# Altium schematic sheet Main Display Module ESP32.SchDoc
size 381 x 241 mm; SheetNumber: 1; SheetTotal: 1
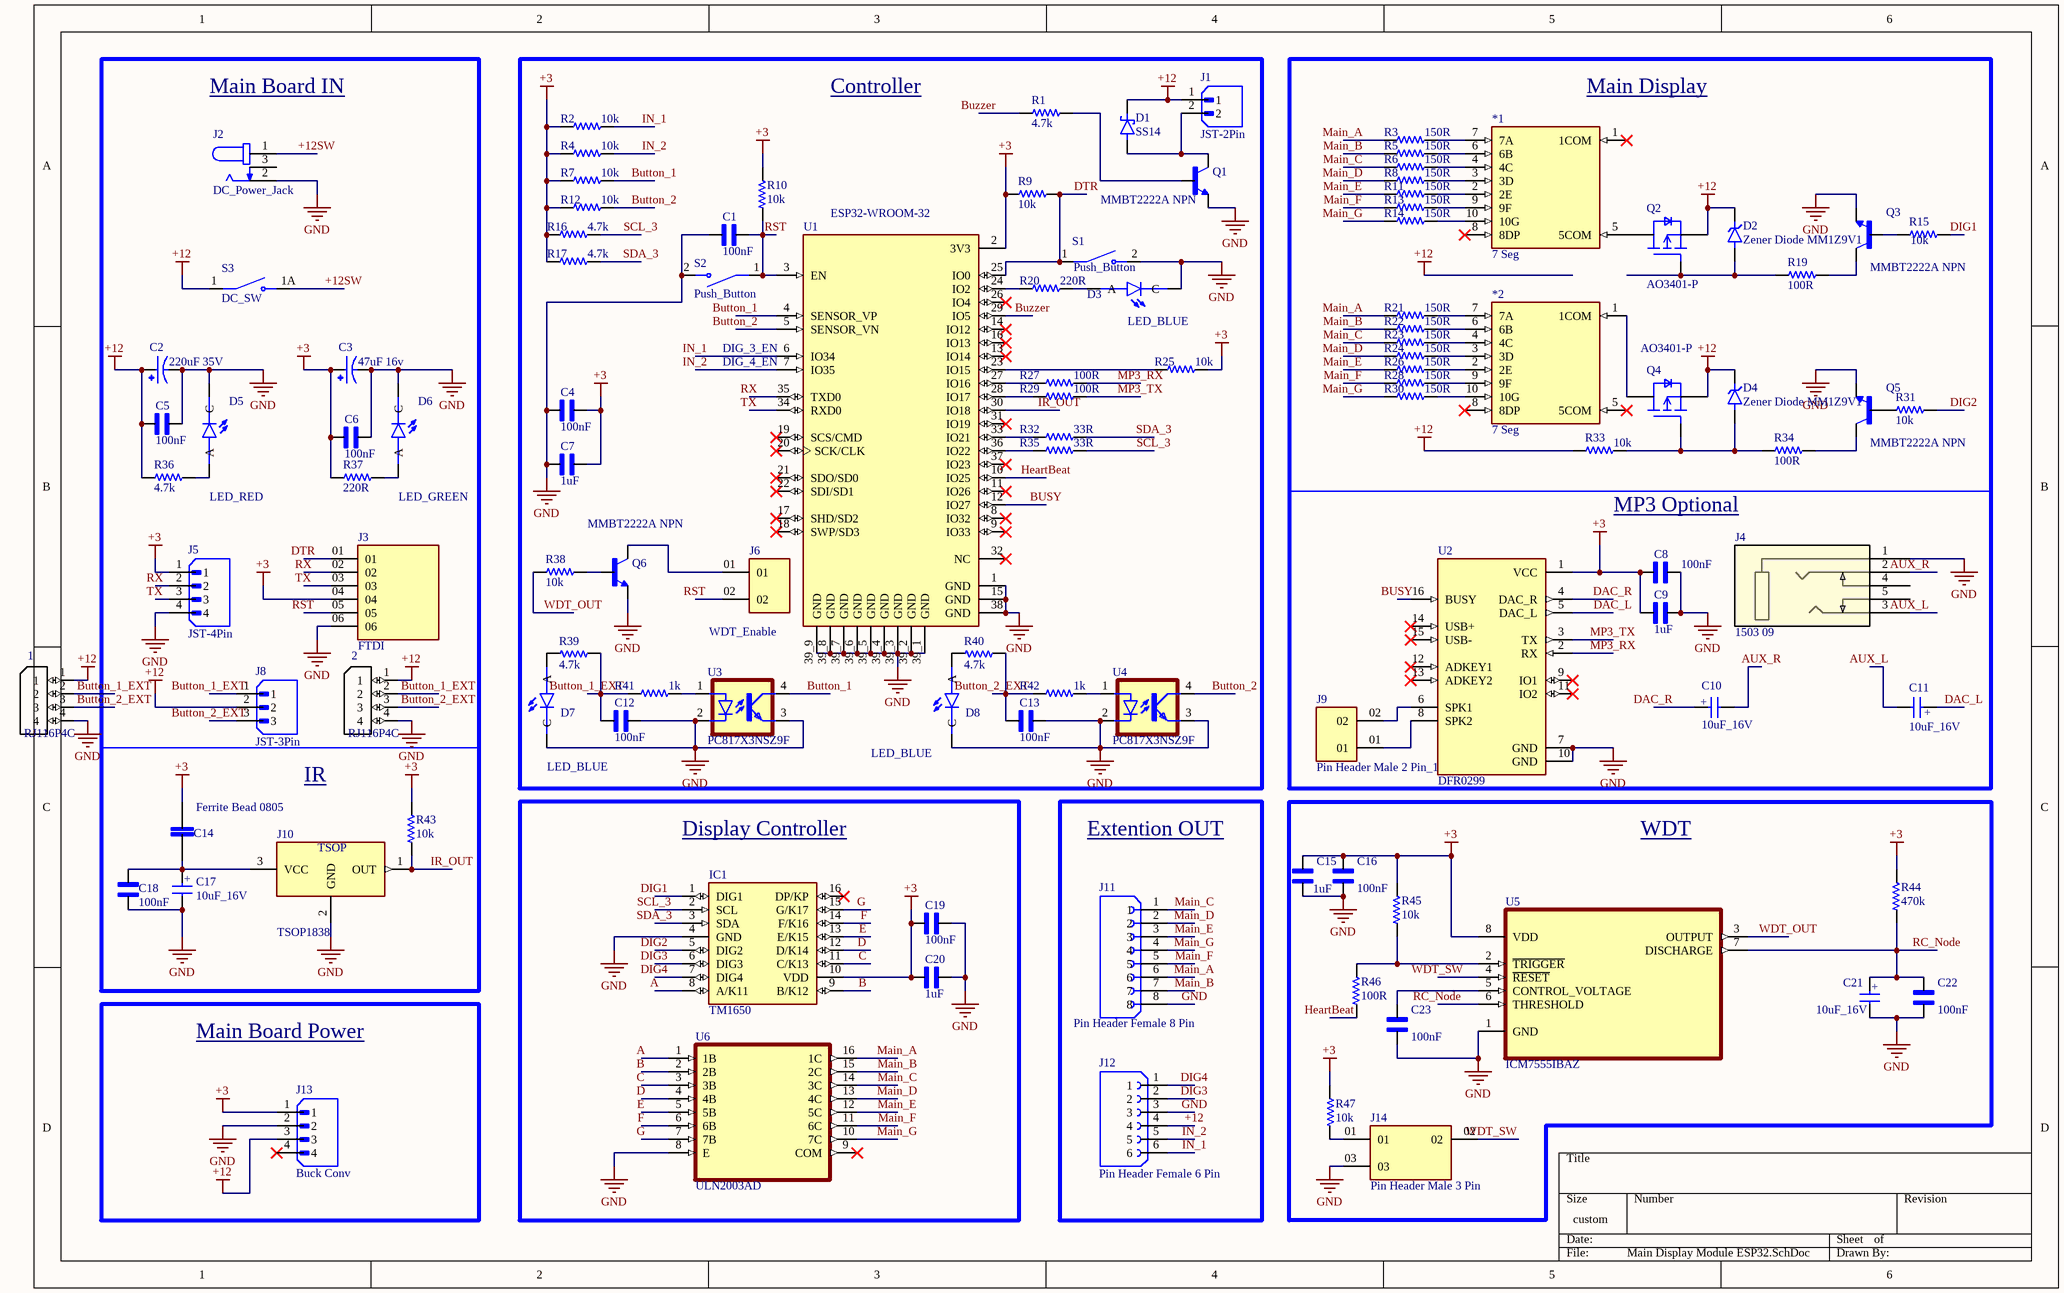
[diagram p0: Main Display Module ESP32.SchDoc]

## Parts
1  RJ116P4C  [*RJ6P4C]
2  RJ116P4C  [*RJ6P4C]
*1  7 Seg  [2.3_7-SEG_DIS]
*2  7 Seg  [2.3_7-SEG_DIS]
C1  100nF  [Capacitor 0805]
C2  220uF 35V  [220uF 35V]
C3  47uF 16v  [47uf 16v]
C4  100nF  [Capacitor 0805]
C5  100nF  [Capacitor 0805]
C6  100nF  [Capacitor 0805]
C7  1uF  [Capacitor 0805]
C8  100nF  [Capacitor 0805]
C9  1uF  [Capacitor 0805]
C10  10uF_16V  [10uF_16V]
C11  10uF_16V  [10uF_16V]
C12  100nF  [Capacitor 0805]
C13  100nF  [Capacitor 0805]
C14  Ferrite Bead 0805  [Ferrite Bead 0805]
C15  1uF  [Capacitor 0805]
C16  100nF  [Capacitor 0805]
C17  10uF_16V  [10uF_16V]
C18  100nF  [Capacitor 0805]
C19  100nF  [Capacitor 0805]
C20  1uF  [Capacitor 0805]
C21  10uF_16V  [10uF_16V]
C22  100nF  [Capacitor 0805]
C23  100nF  [Capacitor 0805]
D1  SS14  [SS14]
D2  Zener Diode MM1Z9V1  [Zener 9.1V SOD123]
D3  LED_BLUE  [LED_0603]
D4  Zener Diode MM1Z9V1  [Zener 9.1V SOD123]
D5  LED_RED  [LED_0603]
D6  LED_GREEN  [LED_0603]
D7  LED_BLUE  [LED_0603]
D8  LED_BLUE  [LED_0603]
IC1  TM1650  [TM1650 SOIC127]
J1  JST-2Pin  [JST-2Pin]
J2  DC_Power_Jack  [DC_Power_Jack]
J3  FTDI  [6Pin-M-Header_6MX1-254MM]
J4  1503 09  [3.5mm_AUX]
J5  JST-4Pin  [4Pin-M-Header_3MX1-254MM]
J6  WDT_Enable  [2Pin-M-Header_3MX1-254MM - duplicate]
J8  JST-3Pin  [JST-3Pin]
J9  Pin Header Male 2 Pin_1  [2Pin-M-Header_3MX1-254MM - duplicate]
J10  TSOP1838  [TSOP1838]
J11  Pin Header Female 8 Pin  [8Pin-F-Header_8FX1-254MM]
J12  Pin Header Female 6 Pin  [6Pin-F-Header_6FX1-254MM]
J13  Buck Conv  [Regulator Buck-Conv]
J14  Pin Header Male 3 Pin  [3Pin-M-Header_3MX1-254MM - duplicate - duplicate]
Q1  MMBT2222A NPN  [NPN_SOT23]
Q2  AO3401-P  [AO-3401-P-SOT23-3]
Q3  MMBT2222A NPN  [NPN_SOT23]
Q4  AO3401-P  [AO-3401-P-SOT23-3]
Q5  MMBT2222A NPN  [NPN_SOT23]
Q6  MMBT2222A NPN  [NPN_SOT23]
R1  4.7k  [RES0603]
R2  10k  [RES0603]
R3  150R  [Resistor 1206]
R4  10k  [RES0603]
R5  150R  [Resistor 1206]
R6  150R  [Resistor 1206]
R7  10k  [RES0603]
R8  150R  [Resistor 1206]
R9  10k  [RES0603]
R10  10k  [RES0603]
R11  150R  [Resistor 1206]
R12  10k  [RES0603]
R13  150R  [Resistor 1206]
R14  150R  [Resistor 1206]
R15  10k  [RES0603]
R16  4.7k  [RES0603]
R17  4.7k  [RES0603]
R19  100R  [RES0603]
R20  220R  [RES0603]
R21  150R  [Resistor 1206]
R22  150R  [Resistor 1206]
R23  150R  [Resistor 1206]
R24  150R  [Resistor 1206]
R25  10k  [RES0603]
R26  150R  [Resistor 1206]
R27  100R  [RES0603]
R28  150R  [Resistor 1206]
R29  100R  [RES0603]
R30  150R  [Resistor 1206]
R31  10k  [RES0603]
R32  33R  [RES0603]
R33  10k  [RES0603]
R34  100R  [RES0603]
R35  33R  [RES0603]
R36  4.7k  [RES0603]
R37  220R  [RES0603]
R38  10k  [RES0603]
R39  4.7k  [RES0603]
R40  4.7k  [RES0603]
R41  1k  [RES0603]
R42  1k  [RES0603]
R43  10k  [RES0603]
R44  470k  [RES0603]
R45  10k  [RES0603]
R46  100R  [RES0603]
R47  10k  [RES0603]
S1  Push_Button  [Push_Button]
S2  Push_Button  [Push_Button]
S3  DC_SW  [DC_SW]
U1  ESP32-WROOM-32  [MODULE_ESP32-WROOM-32]
U2  DFR0299  [MODULE_DFR0299_DIP]
U3  PC817X3NSZ9F  [PC 817]
U4  PC817X3NSZ9F  [PC 817]
U5  ICM7555IBAZ  [ICM7555]
U6  ULN2003AD  [ULN 2003 SOIC127P600X175-16N]

## Blocks framed on the sheet
Controller: C1 C4 C7 C12 C13 D1 D3 D7 D8 J1 J6 Q1 Q6 R1 R2 R4 R7 R9 R10 R12 R16 R17 R20 R25 R27 R29 R32 R35 R38-R42 S1 S2 U1 U3 U4
Display Controller: C19 C20 IC1 U6
Extention OUT: J11 J12
WDT: C15 C16 C21-C23 J14 R44-R47 U5
Main Board Power: J13

## Nets
+3: C3.1 C4.2 C6.1 C7.2 C8.1 C9.1 C14.2 C15.2 C16.2 C19.1 C20.1 IC1.10(VDD) J3.04 J5.1 J13.1 R2.1 R4.1 R7.1 R9.1 R10.2 R12.1 R16.1 R17.1 R25.2 R37.1 R43.2 R44.2 R45.2 R47.1 U1.2(3V3) U2.1(VCC) U5.8(VDD)
+12: 1.1 2.1 C2.1 C5.1 D1.C(K) D2.C D4.C J1.1 J8.2 J12.4 J13.3 Q2.2(S) Q4.2(S) R33.1 R36.1 S3.1
GND: 1.4 2.4 C1.1 C2.2 C3.2 C4.1 C5.2 C6.2 C7.1 C8.2 C9.2 C12.1 C13.2 C15.1 C16.1 C17.2(NEG) C18.1 C19.2 C20.2 C21.2(NEG) C22.1 C23.1 D3.C D5.C D6.C D7.C D8.C IC1.4(GND) J2.2 J3.06 J4.1 J5.4 J10.2(GND) J11.8 J12.3 J13.2 J14.03 Q1.2(E) Q3.2(E) Q5.2(E) Q6.2(E) S1.2 S2.2 U1.1(GND) U1.15(GND) U1.38(GND) U1.39_1(GND) U1.39_2(GND) U1.39_3(GND) U1.39_4(GND) U1.39_5(GND) U1.39_6(GND) U1.39_7(GND) U1.39_8(GND) U1.39_9(GND) U2.7(GND) U2.10(GND) U3.2(C) U3.3(EMIT) U4.2(C) U4.3(EMIT) U5.1(GND) U6.8(E)
+12SW: J2.1 S3.1A
A: IC1.8(A/K11) U6.1(1B)
AUX_L: C11.2(NEG) J4.3
AUX_R: C10.2(NEG) J4.2
B: IC1.9(B/K12) U6.2(2B)
BUSY: U1.12(IO27) U2.16(BUSY)
Button_1: R7.2 U1.4(SENSOR_VP) U3.4(COL)
Button_1_EXT: 1.2 2.2 C12.2 J8.1 R39.1 R41.1
Button_2: R12.2 U1.5(SENSOR_VN) U4.4(COL)
Button_2_EXT: 1.3 2.3 C13.1 J8.3 R40.1 R42.1
Buzzer: R1.1 U1.29(IO5)
C: IC1.11(C/K13) U6.3(3B)
D: IC1.12(D/K14) U6.4(4B)
DAC_L: C11.1(POS) U2.5(DAC_L)
DAC_R: C10.1(POS) U2.4(DAC_R)
DIG1: IC1.1(DIG1) R15.2
DIG2: IC1.5(DIG2) R31.2
DIG3: IC1.6(DIG3) J12.2
DIG4: IC1.7(DIG4) J12.1
DTR: J3.01 R9.2 S1.1 U1.25(IO0)
E: IC1.13(E/K15) U6.5(5B)
F: IC1.14(F/K16) U6.6(6B)
G: IC1.15(G/K17) U6.7(7B)
HeartBeat: R46.1 U1.10(IO25)
IN_1: J12.6 R2.2 U1.6(IO34)
IN_2: J12.5 R4.2 U1.7(IO35)
IR_OUT: J10.1(OUT) R43.1 U1.30(IO18)
Main_A: J11.6 R3.1 R21.1 U6.16(1C)
Main_B: J11.7 R5.1 R22.1 U6.15(2C)
Main_C: J11.1 R6.1 R23.1 U6.14(3C)
Main_D: J11.2 R8.1 R24.1 U6.13(4C)
Main_E: J11.3 R11.1 R26.1 U6.12(5C)
Main_F: J11.5 R13.1 R28.1 U6.11(6C)
Main_G: J11.4 R14.1 R30.1 U6.10(7C)
MP3_RX: R27.2 U2.2(RX)
MP3_TX: R29.2 U2.3(TX)
RC_Node: C21.1(POS) C22.2 R44.1 U5.6(THRESHOLD) U5.7(DISCHARGE)
RST: C1.2 J3.05 J6.02 R10.1 S2.1 U1.3(EN)
RX: J3.02 J5.2 U1.35(TXD0)
SCL_3: IC1.2(SCL) R16.2 R35.2
SDA_3: IC1.3(SDA) R17.2 R32.2
TX: J3.03 J5.3 U1.34(RXD0)
WDT_OUT: R38.1 U5.3(OUTPUT)
WDT_SW: J14.02 U5.4(~{RESET})
Net*1_2: *1.2(2E) R11.2
Net*1_3: *1.3(3D) R8.2
Net*1_4: *1.4(4C) R6.2
Net*1_5: *1.5(5COM) Q2.3(D)
Net*1_6: *1.6(6B) R5.2
Net*1_7: *1.7(7A) R3.2
Net*1_9: *1.9(9F) R13.2
Net*1_10: *1.10(10G) R14.2
Net*2_1: *2.1(1COM) Q4.3(D)
Net*2_2: *2.2(2E) R26.2
Net*2_3: *2.3(3D) R24.2
Net*2_4: *2.4(4C) R23.2
Net*2_6: *2.6(6B) R22.2
Net*2_7: *2.7(7A) R21.2
Net*2_9: *2.9(9F) R28.2
Net*2_10: *2.10(10G) R30.2
NetC14_1: C14.1 C17.1(POS) C18.2 J10.3(VCC)
NetC23_2: C23.2 U5.5(CONTROL_VOLTAGE)
NetD1_A: D1.A J1.2 Q1.3(C)
NetD2_A: D2.A Q2.1(G) R19.1
NetD3_A: D3.A R20.2
NetD4_A: D4.A Q4.1(G) R33.2 R34.1
NetD5_A: D5.A R36.2
NetD6_A: D6.A R37.2
NetD7_A: D7.A R39.2
NetD8_A: D8.A R40.2
NetJ6_01: J6.01 Q6.3(C)
NetJ9_01: J9.01 U2.8(SPK2)
NetJ9_02: J9.02 U2.6(SPK1)
NetJ14_01: J14.01 R47.2
NetQ1_1: Q1.1(B) R1.2
NetQ3_1: Q3.1(B) R15.1
NetQ3_3: Q3.3(C) R19.2
NetQ5_1: Q5.1(B) R31.1
NetQ5_3: Q5.3(C) R34.2
NetQ6_1: Q6.1(B) R38.2
NetR20_1: R20.1 U1.24(IO2)
NetR25_1: R25.1 U1.23(IO15)
NetR27_1: R27.1 U1.27(IO16)
NetR29_1: R29.1 U1.28(IO17)
NetR32_1: R32.1 U1.33(IO21)
NetR35_1: R35.1 U1.36(IO22)
NetR41_2: R41.2 U3.1(A)
NetR42_2: R42.2 U4.1(A)
NetR45_1: R45.1 R46.2 U5.2(~{TRIGGER})

Not connected (* = marked no-connect by the designer): *1 1(1COM)* 8(8DP)*; *2 5(5COM)* 8(8DP)*; IC1 16(DP/KP)*; J2 3; J4 4 5; J13 4*; U1 8(IO32)* 9(IO33)* 11(IO26)* 13(IO14)* 14(IO12)* 16(IO13)* 17(SHD/SD2)* 18(SWP/SD3)* 19(SCS/CMD)* 20(SCK/CLK)* 21(SDO/SD0)* 22(SDI/SD1)* 26(IO4)* 31(IO19)* 32(NC)* 37(IO23)*; U2 9(IO1)* 11(IO2)* 12(ADKEY1)* 13(ADKEY2)* 14(USB+)* 15(USB-)*; U6 9(COM)*

## Notes on the sheet
- Main Board IN
- (near *1) Main Display
- (near U1) DIG_3_EN
- (near U1) DIG_4_EN
- MP3 Optional
- IR
- (in symbol 10uF_16V) +
- (in symbol TSOP1838) TSOP

## Library data of the parts
1 2 = RJ116P4C: MF: TE Connectivity / Raychem; MP: RJ11-6P4C; SnapEDA_Link: https://www.snapeda.com/parts/RJ11-6P4C/TE+Connectivity+%252F+Raychem/view-part/?ref=snap; Package: None; Check_prices: https://www.snapeda.com/parts/RJ11-6P4C/TE+Connectivity+%252F+Raychem/view-part/?ref=eda; Value: *
C1 C4-C9 C12 C13 C15 C16 C18-C20 C22 C23 = Capacitor 0805: 0.1 ÂµF Â±10% 50V Ceramic Capacitor X7R 0805 (2012 Metric); MF: Murata; MP: GCE21BR71H104KA01L; SnapEDA_Link: https://www.snapeda.com/parts/GCE21BR71H104KA01L/Murata+Electronics+North+America/view-part/?ref=snap; Package: 2012 Murata; Value: *; Check_prices: https://www.snapeda.com/parts/GCE21BR71H104KA01L/Murata+Electronics+North+America/view-part/?ref=eda
C2 = 220uF 35V: 220ÂµF 35V Aluminum Electrolytic Capacitors Radial, Can - SMD 2000 Hrs @ 85Â°C; MP: EEE1VA221P; MF: Panasonic; Price: None; SnapEDA_Link: https://www.snapeda.com/parts/EEE1VA221P/Panasonic/view-part/?ref=snap; Check_prices: https://www.snapeda.com/parts/EEE1VA221P/Panasonic/view-part/?ref=eda; Package: RADIAL-2 Panasonic; Availability: In Stock; Value: *
C3 = 47uF 16v: 47ÂµF 16V Aluminum Electrolytic Capacitors Radial, Can - SMD 1000 Hrs @ 105Â°C; MF: Panasonic; MP: EEE-HA1C470P; SnapEDA_Link: https://www.snapeda.com/parts/EEE-HA1C470P/Panasonic/view-part/2303036/?ref=snap; Package: RADIAL-2 Panasonic; Purchase-URL: https://pricing.snapeda.com/search/part/EEE-HA1C470P/?ref=eda; Price: None; Value: *; Check_prices: https://www.snapeda.com/parts/EEE-HA1C470P/Panasonic/view-part/2303036/?ref=eda; Availability: In Stock
C10 C11 C17 C21 = 10uF_16V: CAP, 10UF, 16V, ALU ELEC, SMD; AE Capacitor Case:Radial Can - SMD; Capacitance:10ÂµF; Voltage Rating:16V; ESR:-; Product Range:WCAP-ASLU Series; Lifetime @ Temperature:2000 hours @ 85Â°C; Operating Temperature Min:-40Â°C; Operating Temperature Max:85Â°C;; MF: WÃ¼rth Elektronik; MP: 865090368008; SnapEDA_Link: https://www.snapeda.com/parts/865090368008/W%25C3%25BCrth+Elektronik+Midcom/view-part/?ref=snap; Package: None; Value: *; Check_prices: https://www.snapeda.com/parts/865090368008/W%25C3%25BCrth+Elektronik+Midcom/view-part/?ref=eda
C14 = Ferrite Bead 0805: BLM Series 0805 1 kOhm 200 mA 0.45 DCR Surface Mount Ferrite Bead; MF: Murata; MP: BLM21AH102SN1D; SnapEDA_Link: https://www.snapeda.com/parts/BLM21AH102SN1D/Murata/view-part/?ref=snap; Package: 805-2 Murata; Value: *; Check_prices: https://www.snapeda.com/parts/BLM21AH102SN1D/Murata/view-part/?ref=eda
D1 = SS14: 1A, 40V, Schottky Rectifier; MF: Taiwan Semiconductor; SnapEDA_Link: https://www.snapeda.com/parts/SS14/taiwan/view-part/?ref=snap; Package: SMA-2 Taiwan Semiconductor; Value: *; MP: SS14; Check_prices: https://www.snapeda.com/parts/SS14/taiwan/view-part/?ref=eda
D2 D4 = Zener Diode MM1Z9V1: Zener Diode 3.9 V 500 mW Â±5% Surface Mount SOD-123; MF: Diodes Inc.; MP: BZT52C3V9-7-F; SnapEDA_Link: https://www.snapeda.com/parts/BZT52C3V9-7-F/Diodes+Inc./view-part/?ref=snap; Package: SOD-123 Fairchild Semiconductor; Value: *; Check_prices: https://www.snapeda.com/parts/BZT52C3V9-7-F/Diodes+Inc./view-part/?ref=eda
D3 D5-D8 = LED_0603: SMD LED 0603 INGAN GREEN | Dialight 597-3326-607F; SnapEDA_Link: https://www.snapeda.com/parts/597-3326-607F/Dialight/view-part/?ref=snap; Package: 0603 Dialight; Value: *; MF: Dialight; MP: 597-3326-607F; Check_prices: https://www.snapeda.com/parts/597-3326-607F/Dialight/view-part/?ref=eda
IC1 = TM1650: <b>The TM1650 is a dedicated LED (LED display) drive control circuit with a keyboard scan interface. The MCU input and output control digital interface, data latch, LED driver, keyboard scan, brightness adjustment and other circuits are integrated inside. The TM1650's stable performance, reliable quality, and high immunity to interference make it suitable for long-term continuous operation in 24 hours</b><p> Source: <a href="http://www.titanmec.com/index.php/en/product/download/id/540.html"> Datasheet </a>; MF: tm; Package: None; Price: None; Value: *; SnapEDA_Link: https://www.snapeda.com/parts/TM1650/TMMH/view-part/?ref=snap; MP: TM1650; Availability: Not in stock; Check_prices: https://www.snapeda.com/parts/TM1650/TMMH/view-part/?ref=eda
J1 = JST-2Pin: Connector Header Through Hole 2 position 0.098 (2.50mm); MF: JST Sales; MP: B2B-XH-A(LF)(SN); SnapEDA_Link: https://www.snapeda.com/parts/B2B-XH-A(LF)(SN)/JST/view-part/?ref=snap; Package: None; Value: *; Check_prices: https://www.snapeda.com/parts/B2B-XH-A(LF)(SN)/JST/view-part/?ref=eda
J2 = DC_Power_Jack: Power Barrel Connector Jack 2.05mm ID (0.081), 5.50mm OD (0.217) Through Hole, Right Angle; MF: Global Connector Technology; MP: DCJ200-10-A-K1-K; SnapEDA_Link: https://www.snapeda.com/parts/DCJ200-10-A-K1-K/Global+Connector+Technology/view-part/?ref=snap; Package: None; Value: *; Check_prices: https://www.snapeda.com/parts/DCJ200-10-A-K1-K/Global+Connector+Technology/view-part/?ref=eda
J3 = Pin Header Male 6 Pin: MP: MTSW-106-24-G-S-300; Value: *; Availability: Unavailable; Package: None; Price: None
J4 = 3.5mm_AUX: Description; Manufacturer_Name: Lumberg; Copyright: Copyright (C) 2025 Ultra Librarian. All rights reserved.; Manufacturer_Part_Number: 1503 09; RefDes: RefDes; Type: Type
J5 = JST-4Pin: Connector Header Through Hole 4 position 0.098 (2.50mm); MF: JST Sales; MP: B4B-XH-A(LF)(SN); SnapEDA_Link: https://www.snapeda.com/parts/B4B-XH-A(LF)(SN)/JST+Sales+America+Inc./view-part/?ref=snap; Package: None; Value: *; Check_prices: https://www.snapeda.com/parts/B4B-XH-A(LF)(SN)/JST+Sales+America+Inc./view-part/?ref=eda
J6 J9 = Pin Header Male 2 Pin_1: MP: TSW-101-23-L-T; Package: None; Price: None; Value: *; Availability: Unavailable
J8 = JST-3Pin: Connector Header Through Hole 3 position 0.098 (2.50mm); MF: JST Sales America Inc.; MP: B3B-XH-A (LF)(SN); SnapEDA_Link: https://www.snapeda.com/parts/B3B-XH-A%20(LF)(SN)/JST+Sales+America+Inc./view-part/?ref=snap; Package: None; Value: *; Check_prices: https://www.snapeda.com/parts/B3B-XH-A%20(LF)(SN)/JST+Sales+America+Inc./view-part/?ref=eda
J10 = TSOP1838: IR Remote Receiver 38KHz 35m 3-Pin; MF: Vishay; SnapEDA_Link: https://www.snapeda.com/parts/TSOP1838/Vishay/view-part/?ref=snap; Package: None; Value: *; MP: TSOP1838; Check_prices: https://www.snapeda.com/parts/TSOP1838/Vishay/view-part/?ref=eda
J11 = Pin Header Female 8 Pin: Headers & Wire Housings 2.54MM 0.1 8-PIN FEMALE HEADER; MP: 8Fx1-254mm; MF: Gravitech; SnapEDA_Link: https://www.snapeda.com/parts/8Fx1-254mm/Gravitech/view-part/?ref=snap; Price: None; Purchase-URL: https://pricing.snapeda.com/search/part/8Fx1-254mm/?ref=eda; Package: None; Availability: In Stock; Check_prices: https://www.snapeda.com/parts/8Fx1-254mm/Gravitech/view-part/?ref=eda; Value: *
J12 = Pin Header Female 6 Pin: 6 Position Total Single Row 2.54 mm Pitch Straight Female Header; MF: Sullins Connector Solutions; MP: PPTC061LFBNRC; SnapEDA_Link: https://www.snapeda.com/parts/PPTC061LFBNRC/Sullins/view-part/?ref=snap; Package: None; Value: *; Check_prices: https://www.snapeda.com/parts/PPTC061LFBNRC/Sullins/view-part/?ref=eda
J13 = Buck Conv: Connector Header Through Hole 4 position 0.098 (2.50mm); MF: JST Sales; MP: B4B-XH-A(LF)(SN); SnapEDA_Link: https://www.snapeda.com/parts/B4B-XH-A(LF)(SN)/JST+Sales+America+Inc./view-part/?ref=snap; Package: None; Value: *; Check_prices: https://www.snapeda.com/parts/B4B-XH-A(LF)(SN)/JST+Sales+America+Inc./view-part/?ref=eda
J14 = Pin Header Male 3 Pin: MP: TSW-101-23-L-T; Package: None; Price: None; Value: *; Availability: Unavailable
Q1 Q3 Q5 Q6 = MMBT2222A NPN: Bipolar (BJT) Transistor NPN 40V 600mA 300MHz 310mW Surface Mount SOT-23-3; MF: STMicroelectronics; SnapEDA_Link: https://www.snapeda.com/parts/MMBT2222A/STMicroelectronics/view-part/?ref=snap; Package: SOT-23 Multicomp; Value: *; MP: MMBT2222A; Check_prices: https://www.snapeda.com/parts/MMBT2222A/STMicroelectronics/view-part/?ref=eda
Q2 Q4 = AO3401-P: P-Channel 30 V 4A (Ta) 1.4W (Ta) Surface Mount SOT-23-3; MF: Alpha & Omega Semiconductor; MP: AO3401; SnapEDA_Link: https://www.snapeda.com/parts/AO3401/Alpha/view-part/?ref=snap; Package: SOT-23-3 Alpha &amp; Omega Semiconductor; Value: *; Check_prices: https://www.snapeda.com/parts/AO3401/Alpha/view-part/?ref=eda
R1 R2 R4 R7 R9 R10 R12 R15-R17 R19 R20 R25 R27 R29 R31-R47 = Resistor 0603: Fixed Resistor CRGCQ 1206 10K 5%; MF: TE Connectivity; MP: CRGCQ1206J10K; SnapEDA_Link: https://www.snapeda.com/parts/CRGCQ1206J10K/TE+Connectivity/view-part/?ref=snap; Package: 3115 TE Connectivity; Value: *; Check_prices: https://www.snapeda.com/parts/CRGCQ1206J10K/TE+Connectivity/view-part/?ref=eda
R3 R5 R6 R8 R11 R13 R14 R21-R24 R26 R28 R30 = Resistor 1206: Fixed Resistor CRGCQ 1206 10K 5%; MF: TE Connectivity; MP: CRGCQ1206J10K; SnapEDA_Link: https://www.snapeda.com/parts/CRGCQ1206J10K/TE+Connectivity/view-part/?ref=snap; Package: 3115 TE Connectivity; Value: *; Check_prices: https://www.snapeda.com/parts/CRGCQ1206J10K/TE+Connectivity/view-part/?ref=eda
S1 S2 = Push_Button: SWITCH TACTILE SPST-NO 0.05A 12V; MF: E-Switch; MP: TL1107BF130WQ; Check_prices: https://www.snapeda.com/parts/TL1107BF130WQ/E-Switch/view-part/?ref=eda; SnapEDA_Link: https://www.snapeda.com/parts/TL1107BF130WQ/E-Switch/view-part/?ref=snap; Availability: In Stock; Purchase-URL: https://pricing.snapeda.com/search/part/TL1107BF130WQ/?ref=eda; Value: *; Price: None; Package: None
S3 = DC_SW: Rocker Switch,R1966 Series,SPST,ON-OFF,Concave,Black,I/O, 15A, 125VAC,R/A P | E-Switch R1966ABLKBLKFR; SnapEDA_Link: https://www.snapeda.com/parts/R1966ABLKBLKFR/E-Switch/view-part/?ref=snap; Package: None; Value: *; MF: E-Switch; MP: R1966ABLKBLKFR; Check_prices: https://www.snapeda.com/parts/R1966ABLKBLKFR/E-Switch/view-part/?ref=eda
U1 = ESP32-WROOM-32: Bluetooth, WiFi 802.11b/g/n, Bluetooth v4.2 +EDR, Class 1, 2 and 3 Transceiver Module 2.4GHz ~ 2.5GHz Antenna Not Included, U.FL Surface Mount; MF: Espressif Systems; Price: None; Availability: In Stock; MP: ESP32-WROOM-32; Package: Module Espressif Systems; SnapEDA_Link: https://www.snapeda.com/parts/ESP32-WROOM-32/Espressif+Systems/view-part/?ref=snap; Check_prices: https://www.snapeda.com/parts/ESP32-WROOM-32/Espressif+Systems/view-part/?ref=eda; Value: *; Purchase-URL: https://pricing.snapeda.com/search/part/ESP32-WROOM-32/?ref=eda
U2 = DFR0299: - MP3 Player Audio Arduino Platform Evaluation Expansion Board; MF: DFRobot; SnapEDA_Link: https://www.snapeda.com/parts/DFR0299/DFRobot/view-part/?ref=snap; Package: None; Value: *; MP: DFR0299; Check_prices: https://www.snapeda.com/parts/DFR0299/DFRobot/view-part/?ref=eda
U3 U4 = PC817X3NSZ9F: Optoisolator Transistor Output 5000Vrms 1 Channel 4-DIP; MF: Sharp Microelectronics; SnapEDA_Link: https://www.snapeda.com/parts/PC817X3NSZ9F/Sharp+Microelectronics/view-part/?ref=snap; Package: DIP-4 Sharp Microelectronics; Value: *; MP: PC817X3NSZ9F; Check_prices: https://www.snapeda.com/parts/PC817X3NSZ9F/Sharp+Microelectronics/view-part/?ref=eda
U5 = ICM7555IBAZ: 555 Type, Timer/Oscillator (Single) IC 1MHz 8-SOIC; MF: Renesas Electronics America Inc; SnapEDA_Link: https://www.snapeda.com/parts/ICM7555IBAZ/Renesas/view-part/?ref=snap; Package: SOIC-8 Renesas Electronics America Inc; Value: *; MP: ICM7555IBAZ; Check_prices: https://www.snapeda.com/parts/ICM7555IBAZ/Renesas/view-part/?ref=eda
U6 = ULN2003AD: 50-V, 7-ch darlington transistor array, -20C to 70C; MF: Texas Instruments; SnapEDA_Link: https://www.snapeda.com/parts/ULN2003AD/Texas+Instruments/view-part/?ref=snap; Package: SOIC-16 Texas Instruments; Value: *; MP: ULN2003AD; Check_prices: https://www.snapeda.com/parts/ULN2003AD/Texas+Instruments/view-part/?ref=eda